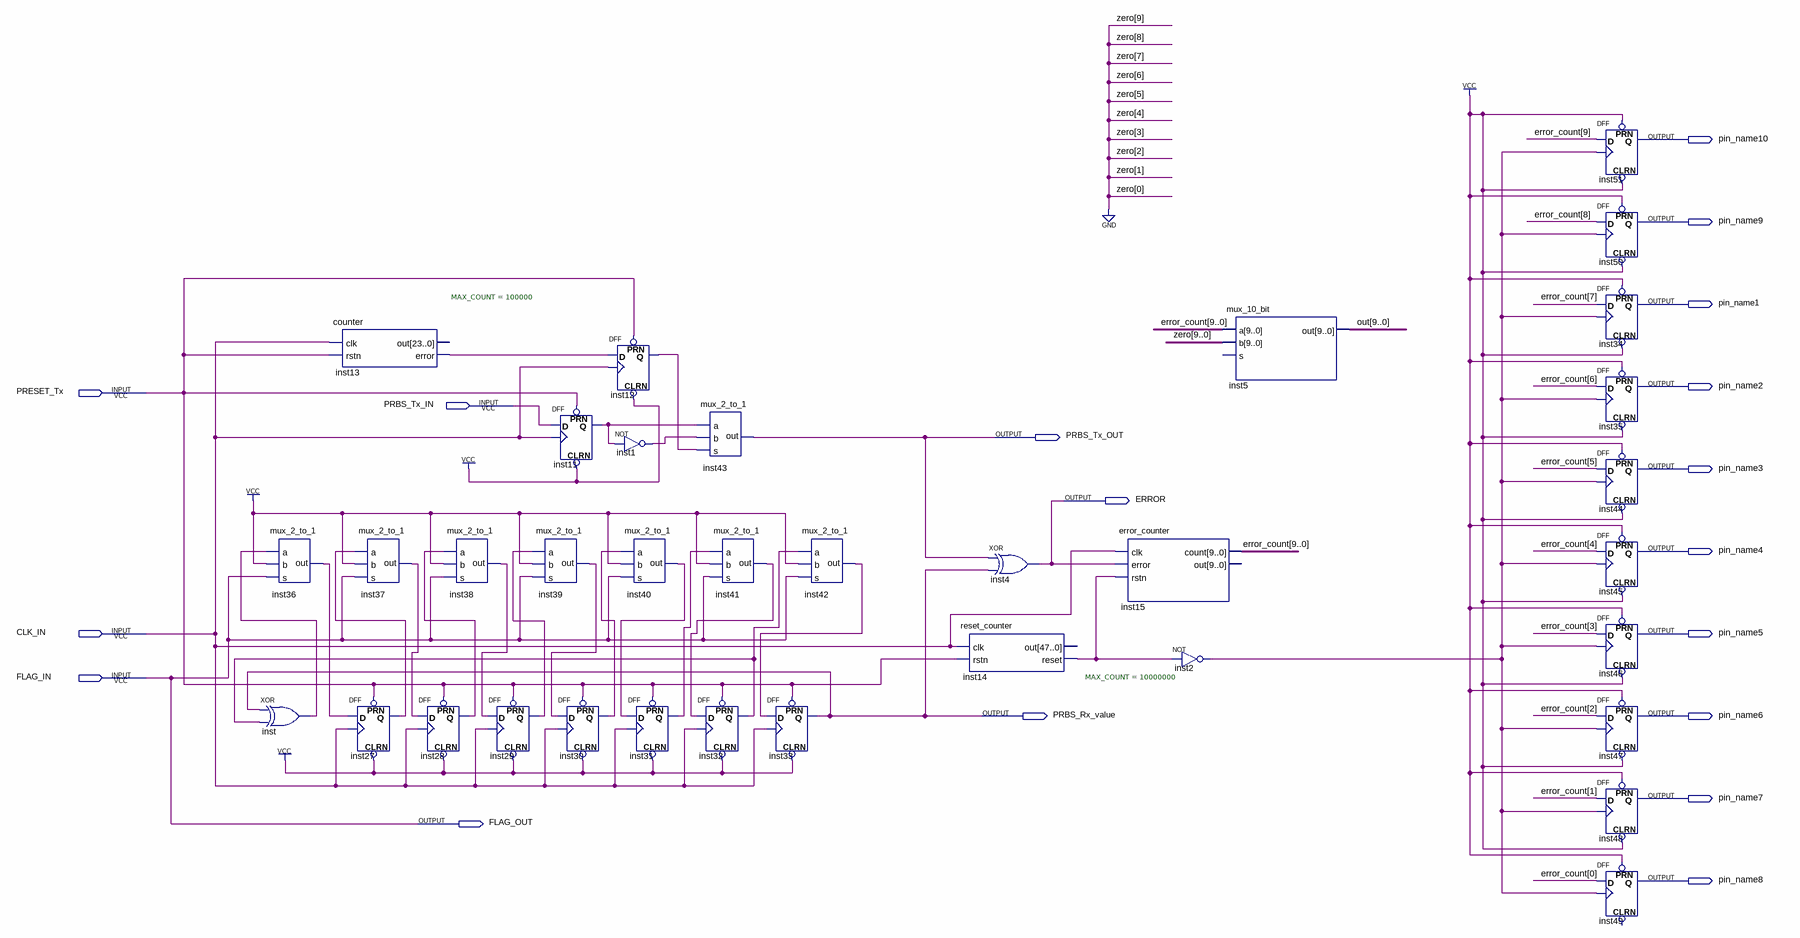
[diagram p0: schematic sheet]
// Quartus schematic BERT_Rx.bdf as structural Verilog: 35 symbols, 18 pins
module BERT_Rx (
  input  PRESET_Tx,
  input  PRBS_Tx_IN,
  input  CLK_IN,
  input  FLAG_IN,
  output pin_name10,
  output pin_name9,
  output pin_name1,
  output pin_name2,
  output PRBS_Tx_OUT,
  output pin_name3,
  output ERROR,
  output pin_name4,
  output pin_name5,
  output PRBS_Rx_value,
  output pin_name6,
  output pin_name7,
  output FLAG_OUT,
  output pin_name8
);

  wire inst1_out, inst2_out, inst11_q, inst12_q, inst13_error, inst14_reset, inst27_q, inst28_q, inst29_q,
       inst30_q, inst31_q, inst32_q, inst36_out, inst37_out, inst38_out, inst39_out, inst40_out, inst41_out,
       inst42_out, inst_out;
  wire [9:0] error_count, out;

  xor inst (inst_out, PRBS_Rx_value, inst32_q);
  mux_2_to_1 inst36 (.a(inst_out), .b(1'b1), .s(FLAG_IN), .out(inst36_out));
  counter #(.MAX_COUNT(100000)) inst13 (.clk(CLK_IN), .rstn(PRESET_Tx), .error(inst13_error));  // open: out
  mux_2_to_1 inst37 (.a(inst27_q), .b(1'b1), .s(FLAG_IN), .out(inst37_out));
  DFF inst27 (.CLRN(1'b1), .CLK(CLK_IN), .D(inst36_out), .PRN(PRESET_Tx), .Q(inst27_q));
  mux_2_to_1 inst38 (.a(inst28_q), .b(1'b1), .s(FLAG_IN), .out(inst38_out));
  DFF inst28 (.CLRN(1'b1), .CLK(CLK_IN), .D(inst37_out), .PRN(PRESET_Tx), .Q(inst28_q));
  DFF inst29 (.CLRN(1'b1), .CLK(CLK_IN), .D(inst38_out), .PRN(PRESET_Tx), .Q(inst29_q));
  DFF inst11 (.CLRN(1'b1), .CLK(CLK_IN), .D(PRBS_Tx_IN), .PRN(PRESET_Tx), .Q(inst11_q));
  mux_2_to_1 inst39 (.a(inst29_q), .b(1'b1), .s(FLAG_IN), .out(inst39_out));
  DFF inst30 (.CLRN(1'b1), .CLK(CLK_IN), .D(inst39_out), .PRN(PRESET_Tx), .Q(inst30_q));
  DFF inst12 (.CLRN(1'b1), .CLK(CLK_IN), .D(inst13_error), .PRN(PRESET_Tx), .Q(inst12_q));
  not inst1 (inst1_out, inst11_q);
  mux_2_to_1 inst40 (.a(inst30_q), .b(1'b1), .s(FLAG_IN), .out(inst40_out));
  DFF inst31 (.CLRN(1'b1), .CLK(CLK_IN), .D(inst40_out), .PRN(PRESET_Tx), .Q(inst31_q));
  mux_2_to_1 inst43 (.a(inst11_q), .b(inst1_out), .s(inst12_q), .out(PRBS_Tx_OUT));
  mux_2_to_1 inst41 (.a(inst31_q), .b(1'b1), .s(FLAG_IN), .out(inst41_out));
  DFF inst32 (.CLRN(1'b1), .CLK(CLK_IN), .D(inst41_out), .PRN(PRESET_Tx), .Q(inst32_q));
  DFF inst33 (.CLRN(1'b1), .CLK(CLK_IN), .D(inst42_out), .PRN(PRESET_Tx), .Q(PRBS_Rx_value));
  mux_2_to_1 inst42 (.a(inst32_q), .b(1'b1), .s(FLAG_IN), .out(inst42_out));
  reset_counter #(.MAX_COUNT(10000000)) inst14 (.clk(CLK_IN), .rstn(PRESET_Tx), .reset(inst14_reset));  // open: out
  xor inst4 (ERROR, PRBS_Tx_OUT, PRBS_Rx_value);
  error_counter inst15 (.clk(CLK_IN), .error(ERROR), .rstn(inst14_reset), .count(error_count));  // open: out
  not inst2 (inst2_out, inst14_reset);
  mux_10_bit inst5 (.a(error_count), .b({10{1'b0}}), .out(out));  // open: s
  DFF inst51 (.CLRN(1'b1), .CLK(inst2_out), .D(error_count[9]), .PRN(1'b1), .Q(pin_name10));
  DFF inst50 (.CLRN(1'b1), .CLK(inst2_out), .D(error_count[8]), .PRN(1'b1), .Q(pin_name9));
  DFF inst34 (.CLRN(1'b1), .CLK(inst2_out), .D(error_count[7]), .PRN(1'b1), .Q(pin_name1));
  DFF inst35 (.CLRN(1'b1), .CLK(inst2_out), .D(error_count[6]), .PRN(1'b1), .Q(pin_name2));
  DFF inst44 (.CLRN(1'b1), .CLK(inst2_out), .D(error_count[5]), .PRN(1'b1), .Q(pin_name3));
  DFF inst45 (.CLRN(1'b1), .CLK(inst2_out), .D(error_count[4]), .PRN(1'b1), .Q(pin_name4));
  DFF inst46 (.CLRN(1'b1), .CLK(inst2_out), .D(error_count[3]), .PRN(1'b1), .Q(pin_name5));
  DFF inst47 (.CLRN(1'b1), .CLK(inst2_out), .D(error_count[2]), .PRN(1'b1), .Q(pin_name6));
  DFF inst48 (.CLRN(1'b1), .CLK(inst2_out), .D(error_count[1]), .PRN(1'b1), .Q(pin_name7));
  DFF inst49 (.CLK(inst2_out), .D(error_count[0]), .PRN(1'b1), .Q(pin_name8));  // open: CLRN

  assign FLAG_OUT = FLAG_IN;
endmodule
